# EAGLE design LasCon (EAGLE 6.5.0)
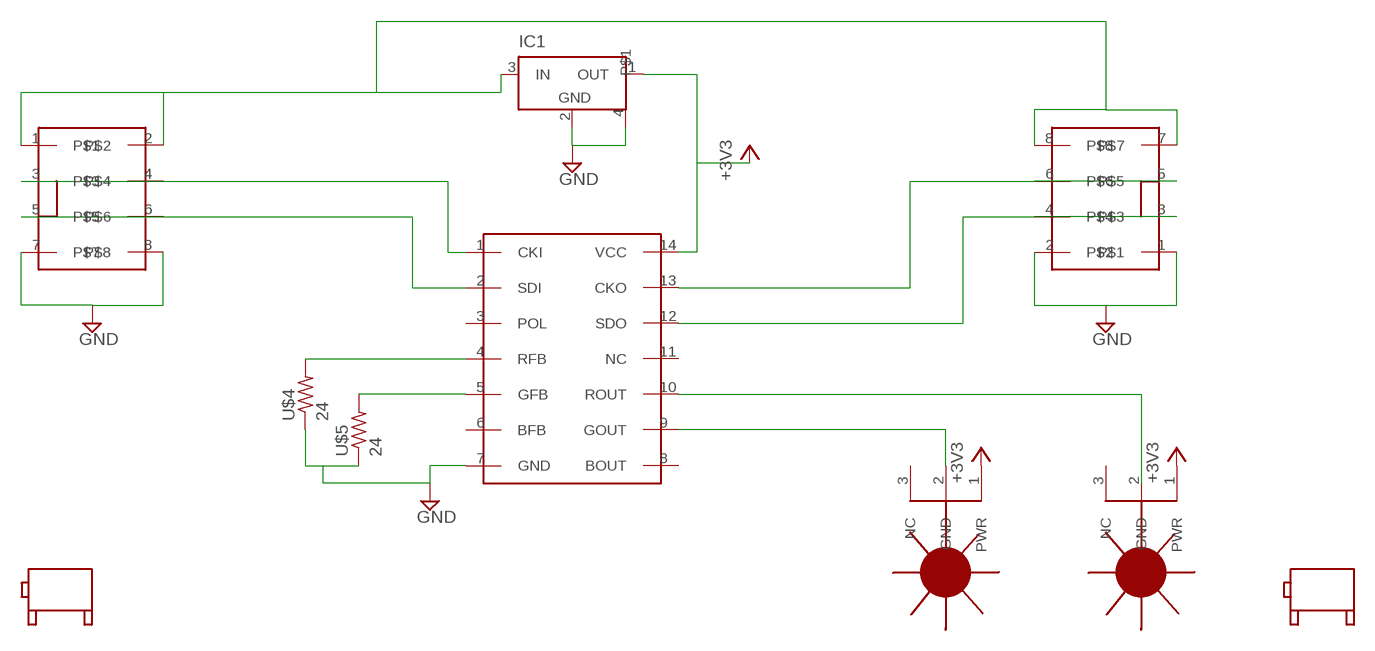
[diagram p0: schematic, sheet 1]

## Parts
IC1  MCP1804T-3302I  [SOT223]
U$1  2X4IDC  [2X04]
U$2  2X4IDC  [2X04]
U$3  WS2801  [SO14]
U$4  24  RF-R0805  [RF-C0805]
U$5  24  RF-R0805  [RF-C0805]
U$6  LASER  [LASER]
U$7  LASER  [LASER]
U$8  90DEGMNT  [90DEGMNT]
U$9  90DEGMNT  [90DEGMNT]

## Nets
+3V3: IC1.1(OUT) U$3.14(VCC) U$6.1(PWR) U$7.1(PWR)
GND: IC1.2(GND) IC1.4 U$1.7 U$1.8 U$2.1 U$2.2 U$3.7(GND) U$4.1 U$5.1
N$1: IC1.3(IN) U$1.1 U$1.2 U$2.7 U$2.8
N$2: U$3.9(GOUT) U$6.2(GND)
N$3: U$3.10(ROUT) U$7.2(GND)
N$5: U$1.3 U$1.4 U$3.1(CKI)
N$6: U$1.5 U$1.6 U$3.2(SDI)
N$7: U$2.5 U$2.6 U$3.13(CKO)
N$8: U$2.3 U$2.4 U$3.12(SDO)
N$9: U$3.4(RFB) U$4.2
N$10: U$3.5(GFB) U$5.2
Unconnected: U$3.3(POL) U$3.6(BFB) U$3.8(BOUT) U$3.11(NC) U$6.3(NC) U$7.3(NC)

## Library data of the parts
IC1 = microchip:MCP1804T-3302I: VOLTAGE REGULATOR; MPN: MCP1804T-3302I
U$1 U$2 = GW-devices:2X4IDC; MPN: 75869-132LF
U$3 = GW-devices:WS2801
U$4 U$5 = GW-devices:RF-R: RF resistor pads for FSL reference design
U$6 U$7 = GW-devices:LASER
U$8 U$9 = GW-devices:90DEGMNT

## Board
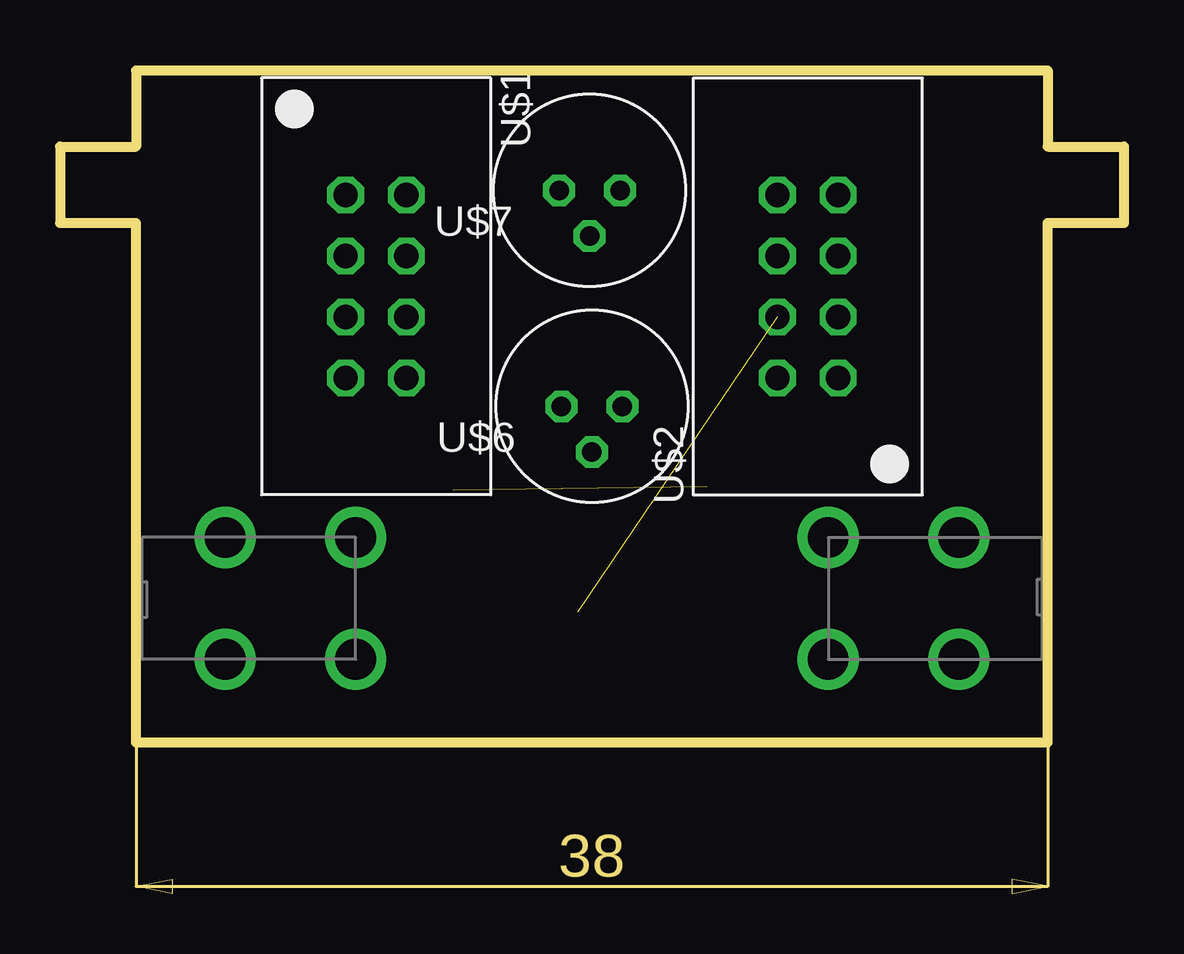
[diagram p1: board, top side]
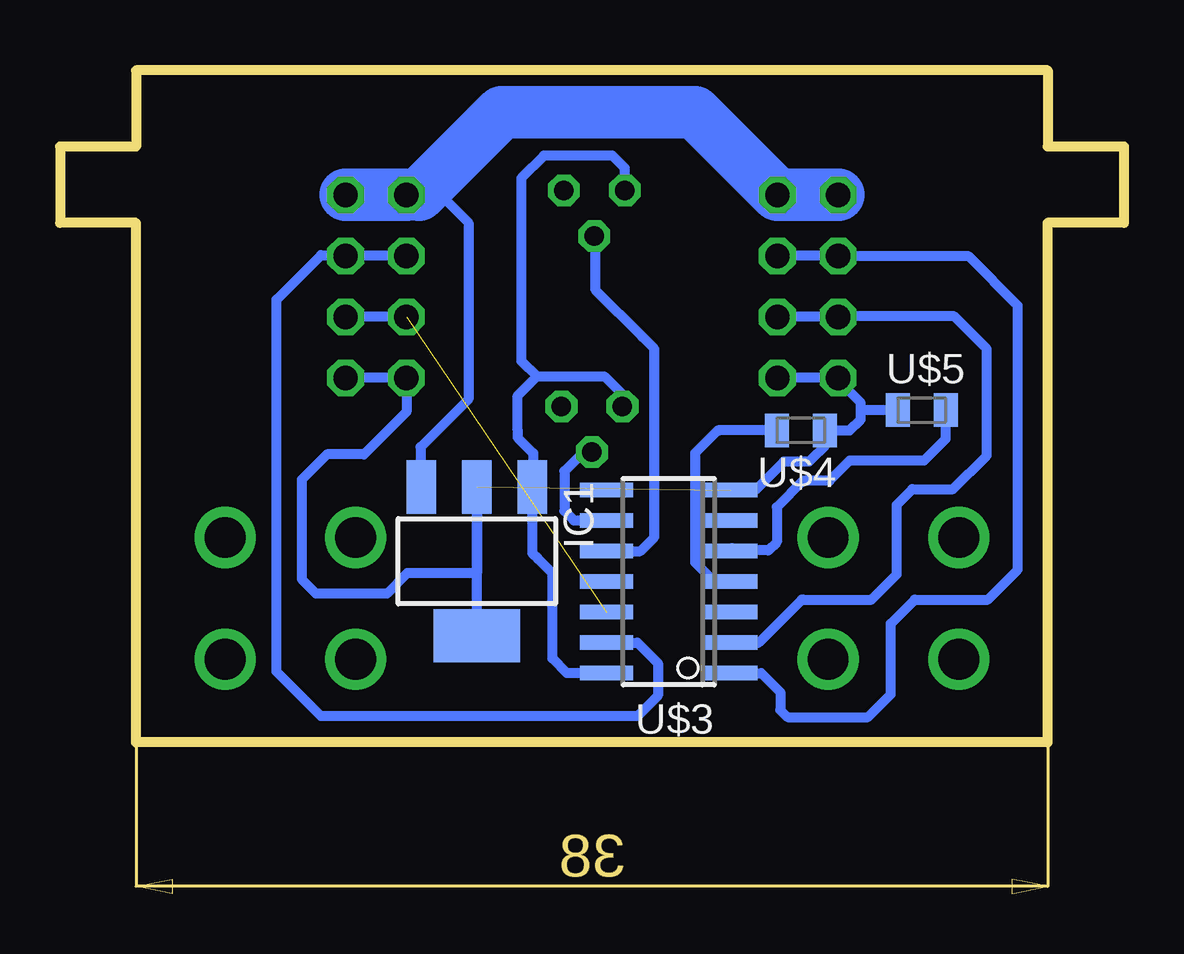
[diagram p2: board, bottom side, seen from below]

Size 44.35 x 28 mm. Coordinates in mm from the lower left corner, seen from the top.
Outline: 41.17,0 41.17,21.65 44.35,21.65 44.35,24.82 41.17,24.82 41.17,28 3.18,28 3.18,24.82 0,24.82 0,21.65 3.18,21.65 3.18,0 41.17,0
Copper layers (1*16): Top 0.0356mm / dielectric 1.5011mm / Bottom 0.0356mm
Design rules "SilverCircuits *": minimum track width 7mil, minimum drill 14mil, track to track 7mil, track to pad 7mil, pad to pad 7mil, via to via 7mil, smd to smd 0mil, copper to edge 20mil, drill to drill 8mil, minimum pad ring 10mil, minimum via ring 8mil, stop-mask expansion 4mil, vias tented up to drill 0mil, thermal gap 10mil

### Footprints (pad centres in the part's own frame; a part is rotated, then mirrored left to right if it is on the bottom)
SOT223 = smd 1.219 x 2.235: 1 -2.311,-3.099; 2 0,-3.099; 3 2.311,-3.099 | smd 3.6 x 2.2: 4 0,3.099
2X04 = drill 1.016 octagon: 1 -3.81,-1.27; 2 -3.81,1.27; 3 -1.27,-1.27; 4 -1.27,1.27; 5 1.27,-1.27; 6 1.27,1.27; 7 3.81,-1.27; 8 3.81,1.27
SO14 = smd 0.6 x 2.2: 1 -3.81,-2.6; 2 -2.54,-2.6; 3 -1.27,-2.6; 4 0,-2.6; 5 1.27,-2.6; 6 2.54,-2.6; 7 3.81,-2.6; 8 3.81,2.6; 9 2.54,2.6; 10 1.27,2.6; 11 0,2.6; 12 -1.27,2.6; 13 -2.54,2.6; 14 -3.81,2.6
RF-C0805 = smd 1 x 1.4: 1 -1,0; 2 1,0
LASER = drill 0.813 octagon: 1 1.27,0; 2 0,1.905; 3 -1.27,0
90DEGMNT = drill 1.7: P$1 -2.72,2.54; P$2 2.72,2.54; P$3 -2.72,-2.54; P$4 2.72,-2.54

### Placement (x,y rotation side)
IC1  26.98,7.55 180 bottom
U$1  13.18,19 270 top
U$2  31.18,19 90 top
U$3  18.98,6.7 90 bottom
U$4  13.48,13 180 bottom
U$5  8.43,13.85 0 bottom
U$6  22.18,14 180 top
U$7  22.07,23 180 top
U$8  9.61,6 0 top
U$9  34.75,6 180 top

### Tracks (layer width: path | path; a pad name or v marks a point on that pad's centre or on a via)
+3V3
  Bottom 0.406: 24.48,15.25 25.28,14.45 25.28,13 25.28,12.7 24.62,12.05 24.62,10.69 IC1.1 24.66,7.89 24.43,7.65 23.82,7.05 23.82,3.5 23.21,2.89 U$3.14 | 24.48,15.25 21.66,15.25 20.91,14.5 U$6.1 | U$7.1 20.8,23.53 20.8,23.93 21.32,24.45 24.18,24.45 25.12,23.5 25.12,15.9 24.48,15.25
GND  (1 unrouted)
  Bottom 0.406: U$1.8 U$1.7 11.91,15.08 10.98,14.15 10.98,13.75 | U$2.1 U$2.2 29.91,13.77 31.68,12 33.23,12 34.27,10.95 34.27,6.8 33.67,6.2 30.73,6.2 29.88,7.05 26.98,7.05 | U$3.7 15.37,10.51 14.18,11.7 13.12,11.7 13.03,11.8 12.48,12.35 U$4.1 11.43,13 10.98,13.45 10.98,13.75 | IC1.4 26.98,7.05 | 26.98,7.05 IC1.2 26.98,7.05 | U$5.1 10.88,13.85 10.98,13.75
N$1
  Bottom 0.406: U$1.2 14.69,22.81 | U$2.8 29.38,22.81 28.48,22.81 27.33,21.65 27.33,14.3 29.33,12.3 29.33,10.69 IC1.3
  Bottom 2.184: U$1.1 U$1.2 17.89,26.25 18.53,26.25 25.41,26.25 25.94,26.25 29.38,22.81 | U$2.8 U$2.7
N$2
  Bottom 0.406: U$6.2 22.53,12.09 23.32,11.3 23.32,9.65 22.93,9.25 U$3.9
N$3
  Bottom 0.406: U$3.10 20.61,7.97 20.16,7.97 19.57,8.55 19.57,16.4 20.07,16.9 22.03,18.85 22.03,21.05 U$7.2
N$5
  Bottom 0.406: U$1.4 U$1.3 11.89,20.25 6.48,20.25 4.43,18.2 4.43,7.2 5.68,5.95 8.73,5.95 9.73,4.95 9.73,2 10.68,1.05 14.03,1.05 14.33,1.35 14.33,2.1 15.12,2.89 U$3.1 16.41,2.85
N$6
  Bottom 0.406: U$1.6 U$1.5 11.89,17.75 7.08,17.75 5.73,16.4 5.73,11.95 7.12,10.55 8.83,10.55 9.48,9.9 9.48,9.4 9.48,7 10.53,5.95 13.38,5.95 13.43,5.95 15.21,4.16 U$3.2
N$7
  Bottom 0.406: U$2.6 U$2.5 32.48,20.3 33.48,20.3 35.33,18.45 35.33,2.95 33.48,1.1 20.28,1.1 19.43,1.95 19.43,3.3 20.29,4.16 U$3.13
N$8  (1 unrouted)
  Bottom 0.406: U$2.4 U$2.3
N$9
  Bottom 0.406: U$4.2 16.88,13 16.93,13 17.88,12.05 17.88,7.5 17.08,6.7 U$3.4
N$10
  Bottom 0.406: 16.34,8 14.83,8 14.48,8.35 14.48,9.8 13.38,10.9 12.28,10.9 11.43,11.75 8.33,11.75 7.43,12.65 U$5.2
  Bottom 0.61: 16.34,8 U$3.5